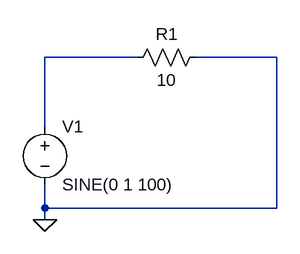
[diagram p0: schematic Yoneda-p58__Sine-wave.asc]
Yoneda-p58__Sine-wave.asc, the LTspice schematic file:
Version 4
SHEET 1 880 680
WIRE 224 0 96 0
WIRE 416 0 304 0
WIRE 96 96 96 0
WIRE 96 208 96 176
WIRE 416 208 416 0
WIRE 416 208 96 208
WIRE 96 224 96 208
FLAG 96 224 0
SYMBOL voltage 96 80 R0
WINDOW 123 0 0 Left 2
WINDOW 39 0 0 Left 2
SYMATTR InstName V1
SYMATTR Value SINE(0 1 100)
SYMBOL res 208 16 R270
WINDOW 0 32 56 VTop 2
WINDOW 3 0 56 VBottom 2
SYMATTR InstName R1
SYMATTR Value 10

The netlist it stands for:
* Yoneda-p58__Sine-wave.asc
V1 N001 0 SINE(0 1 100)
R1 N001 0 10
.backanno
.end